# Altium schematic sheet E9A_05_6231.SchDoc
size A4; SheetNumber: 1; SheetTotal: 1
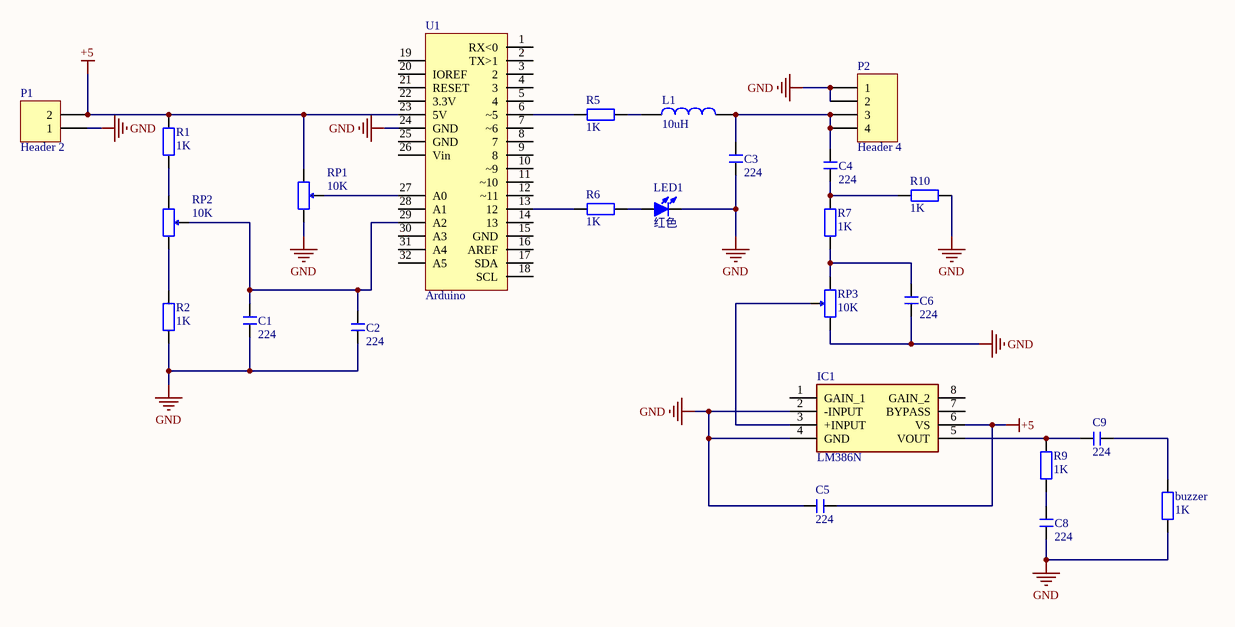
[diagram p0: E9A_05_6231.SchDoc]

## Parts
buzzer  1K  [Buzzer]
C1  224  [MLCC5.08-A]
C2  224  [MLCC5.08-A]
C3  224  [MLCC5.08-A]
C4  224  [MLCC5.08-A]
C5  224  [MLCC5.08-A]
C6  224  [MLCC5.08-A]
C8  224  [MLCC5.08-A]
C9  224  [MLCC5.08-A]
IC1  LM386N  [DIP794W53P254L959H508Q8N]
L1  10uH  [AL0307]
LED1  红色  [LED 3MM-B]
P1  Header 2  [POWER PLUG2]
P2  Header 4  [HDR1X4]
R1  1K  [RS 1/4W]
R2  1K  [RS 1/4W]
R5  1K  [RS 1/4W]
R6  1K  [RS 1/4W]
R7  1K  [RS 1/4W]
R9  1K  [RS 1/4W]
R10  1K  [RS 1/4W]
RP1  10K  [3266Y]
RP2  10K  [3266Y]
RP3  10K  [3266Y]
U1  Arduino  [Arduino-UNO]

## Nets
+5: C5.1 IC1.6(VS) P1.2 R1.2 RP1.1 U1.23(5V)
GND: buzzer.2 C1.1 C2.1 C3.1 C5.2 C6.1 C8.2 IC1.2(-INPUT) IC1.4(GND) LED1.2(K) P1.1 P2.1 P2.2 R2.1 R10.2 RP1.3 RP3.1 U1.24(GND)
Netbuzzer_1: buzzer.1 C9.1
NetC1_2: C1.2 C2.2 RP2.2 U1.29(A2)
NetC3_2: C3.2 C4.2 L1.2 P2.3 P2.4
NetC4_1: C4.1 R7.2 R10.1
NetC6_2: C6.2 R7.1 RP3.3
NetC8_1: C8.1 R9.1
NetC9_2: C9.2 IC1.5(VOUT) R9.2
NetIC1_3: IC1.3(+INPUT) RP3.2
NetL1_1: L1.1 R5.2
NetLED1_1: LED1.1(A) R6.2
NetR1_1: R1.1 RP2.1
NetR2_2: R2.2 RP2.3
NetR5_1: R5.1 U1.6(~5)
NetR6_1: R6.1 U1.13(12)
NetRP1_2: RP1.2 U1.27(A0)

Not connected (* = marked no-connect by the designer): IC1 1(GAIN_1) 7(BYPASS) 8(GAIN_2); U1 1(RX<0) 2(TX>1) 3(2) 4(3) 5(4) 7(~6) 8(7) 9(8) 10(~9) 11(~10) 12(~11) 14(13) 15(GND) 16(AREF) 17(SDA) 18(SCL) 19 20(IOREF) 21(RESET) 22(3.3V) 25(GND) 26(Vin) 28(A1) 30(A3) 31(A4) 32(A5)

## Library data of the parts
buzzer R1 R2 R5-R7 R9 R10 = R-CRR: 直插色环电阻; BOM名称: 色环电阻; 版权归属: 源创客; 学习资源: www.ooocke.com
C1-C6 C8 C9 = C-MLCC: 独石电容; 版权归属: 源创客; BOM名称: 独石电容; 学习资源: www.ooocke.com
IC1 = LM386N: Integrated Circuit; Manufacturer_Name: Texas Instruments; Datasheet Link: http://www.ti.com/lit/ds/symlink/lm386.pdf; Height: 5.08mm; Manufacturer_Part_Number: LM386N; Mouser Part Number: 595-LM386N; Mouser Price/Stock: https://www.mouser.co.uk/ProductDetail/Texas-Instruments/LM386N?qs=E2%2FxqS9xjzoJP%2FIW26Y6YA%3D%3D
L1 = L-AL: 色环电感; 版权归属: 源创客; BOM名称: 色环电感; 学习资源: www.ooocke.com
LED1 = LED-3MM: 插件LED; 版权归属: 源创客; BOM名称: 插件LED; 学习资源: www.ooocke.com
P1 = Header 2: Header, 2-Pin; LatestRevisionDate: 17-Jul-2002; LatestRevisionNote: Re-released for DXP Platform.; Publisher: Altium Limited
P2 = Header 4: Header, 4-Pin; LatestRevisionDate: 17-Jul-2002; LatestRevisionNote: Re-released for DXP Platform.; Publisher: Altium Limited
RP1-RP3 = RP-ID: 插件单联电位器; BOM名称: 插件电位器; 版权归属: 源创客; 学习资源: www.ooocke.com
U1 = Arduino-UNO